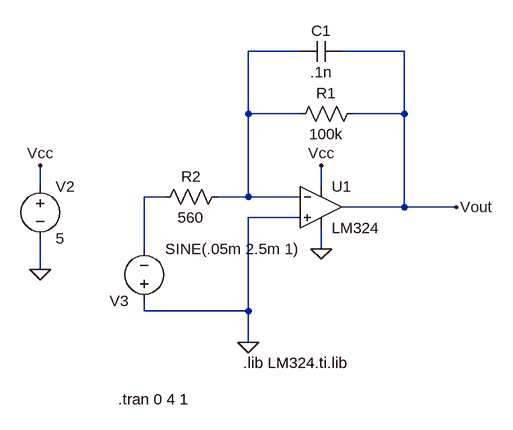
[diagram p0: schematic LM324_OPAMP.asc]
LM324_OPAMP.asc, the LTspice schematic file:
Version 4
SHEET 1 880 680
WIRE 240 -64 160 -64
WIRE 400 -64 304 -64
WIRE 160 32 160 -64
WIRE 240 32 160 32
WIRE 400 32 400 -64
WIRE 400 32 320 32
WIRE -160 144 -160 112
WIRE 272 144 272 112
WIRE 32 160 0 160
WIRE 160 160 160 32
WIRE 160 160 112 160
WIRE 240 160 160 160
WIRE 400 176 400 32
WIRE 400 176 304 176
WIRE 480 176 400 176
WIRE 240 192 160 192
WIRE 0 240 0 160
WIRE 272 240 272 208
WIRE -160 272 -160 224
WIRE 0 336 0 320
WIRE 160 336 160 192
WIRE 160 336 0 336
WIRE 160 384 160 336
FLAG -160 272 0
FLAG -160 112 Vcc
FLAG 272 112 Vcc
FLAG 160 384 0
FLAG 480 176 Vout
FLAG 272 240 0
SYMBOL OpAmps\\opamp2 272 112 R0
SYMATTR InstName U1
SYMATTR Value LM324
SYMBOL voltage -160 128 R0
WINDOW 123 0 0 Left 0
WINDOW 39 0 0 Left 0
SYMATTR InstName V2
SYMATTR Value 5
SYMBOL voltage 0 336 R180
WINDOW 123 0 0 Left 0
WINDOW 39 0 0 Left 0
WINDOW 3 -239 96 Left 2
SYMATTR InstName V3
SYMATTR Value SINE(.05m 2.5m 1)
SYMBOL res 336 16 R90
WINDOW 0 0 56 VBottom 2
WINDOW 3 32 56 VTop 2
SYMATTR InstName R1
SYMATTR Value 100k
SYMBOL cap 304 -80 R90
WINDOW 0 0 32 VBottom 2
WINDOW 3 32 32 VTop 2
SYMATTR InstName C1
SYMATTR Value .1n
SYMBOL res 128 144 R90
WINDOW 0 0 56 VBottom 2
WINDOW 3 32 56 VTop 2
SYMATTR InstName R2
SYMATTR Value 560
TEXT 152 416 Left 2 !.lib LM324.ti.lib
TEXT -40 472 Left 2 !.tran 0 4 1

The netlist it stands for:
* LM324_OPAMP.asc
XU1 0 N001 Vcc 0 Vout LM324  ; pins In+ In- V+ V- OUT
V2 Vcc 0 5
V3 0 N002 SINE(.05m 2.5m 1)
R1 Vout N001 100k
C1 Vout N001 .1n
R2 N001 N002 560
.lib LM324.ti.lib
.tran 0 4 1
.backanno
.end